# Altium schematic sheet SUP_1V.SchDoc
size A4; DocumentNumber: 14; SheetNumber: 14; SheetTotal: 30
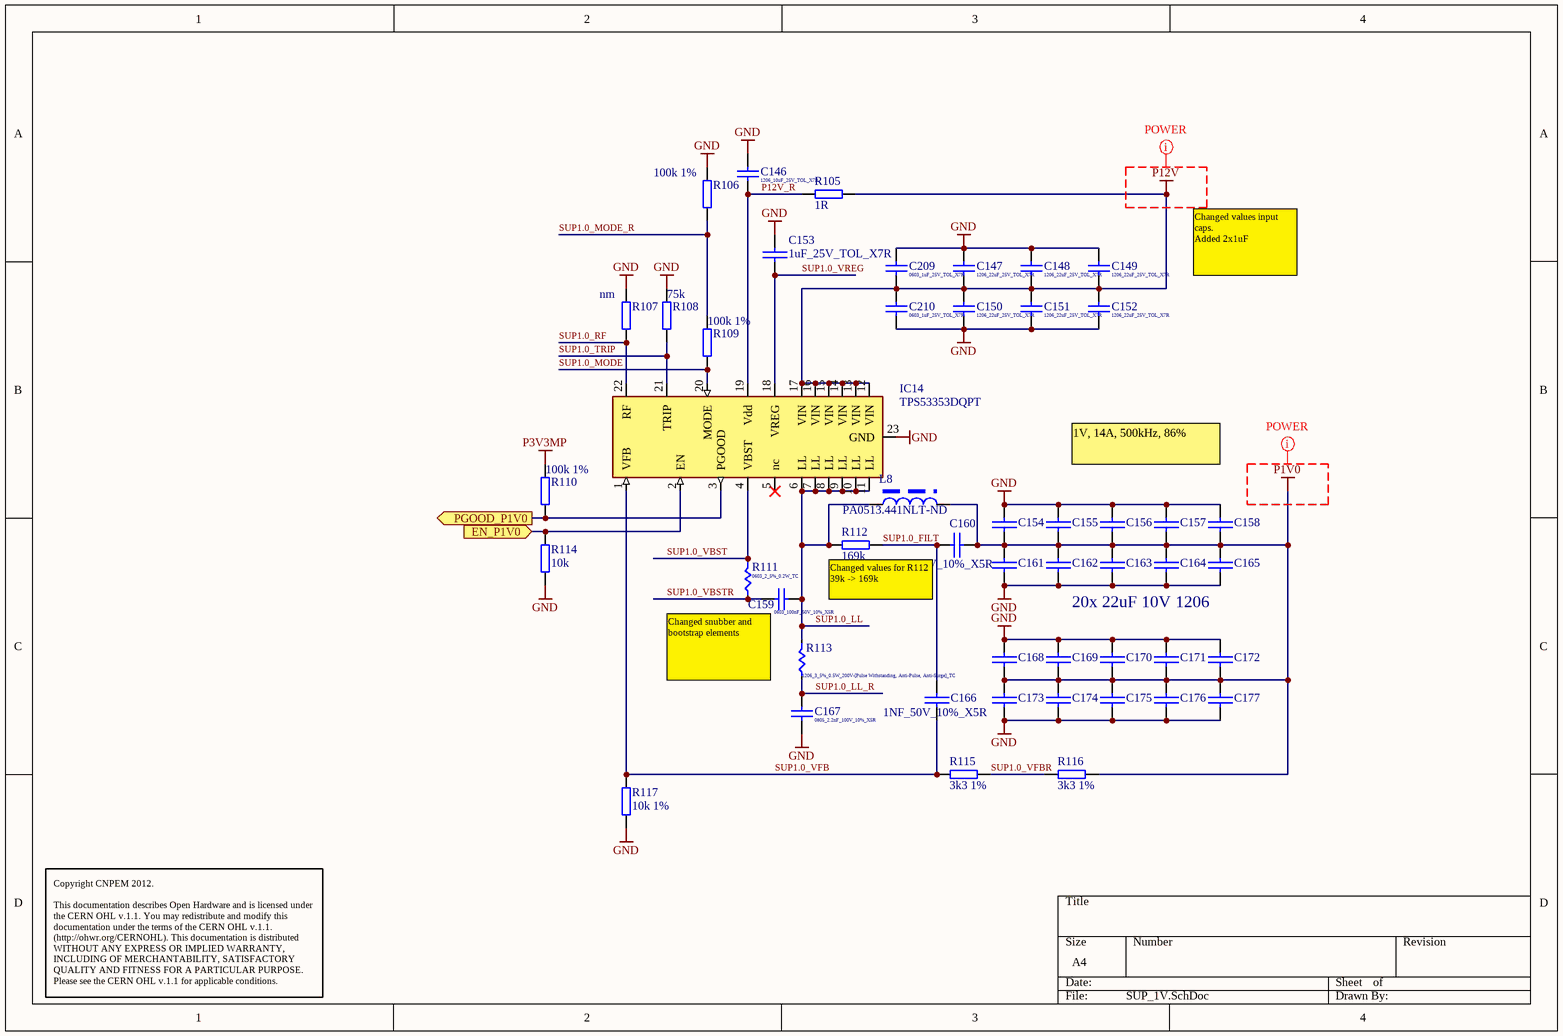
[diagram p0: SUP_1V.SchDoc]

## Parts
C146  1206_10uF_25V_TOL_X7R  [CAPC3225X140N]
C147  1206_22uF_25V_TOL_X7R  [CAPC3225X140N]
C148  1206_22uF_25V_TOL_X7R  [CAPC3225X140N]
C149  1206_22uF_25V_TOL_X7R  [CAPC3225X140N]
C150  1206_22uF_25V_TOL_X7R  [CAPC3225X140N]
C151  1206_22uF_25V_TOL_X7R  [CAPC3225X140N]
C152  1206_22uF_25V_TOL_X7R  [CAPC3225X140N]
C153  1uF_25V_TOL_X7R  [0603C]
C154  22UF_10V_10%_X7R  [1206C]  (value not drawn)
C155  22UF_10V_10%_X7R  [1206C]  (value not drawn)
C156  22UF_10V_10%_X7R  [1206C]  (value not drawn)
C157  22UF_10V_10%_X7R  [1206C]  (value not drawn)
C158  22UF_10V_10%_X7R  [1206C]  (value not drawn)
C159  0603_100nF_50V_10%_X5R  [CAPC1608X90N]
C160  22NF_50V_10%_X5R  [0402C]
C161  22UF_10V_10%_X7R  [1206C]  (value not drawn)
C162  22UF_10V_10%_X7R  [1206C]  (value not drawn)
C163  22UF_10V_10%_X7R  [1206C]  (value not drawn)
C164  22UF_10V_10%_X7R  [1206C]  (value not drawn)
C165  22UF_10V_10%_X7R  [1206C]  (value not drawn)
C166  1NF_50V_10%_X5R  [0402C]
C167  0805_2.2nF_100V_10%_X5R  [CAPC2012X140N]
C168  22UF_10V_10%_X7R  [1206C]  (value not drawn)
C169  22UF_10V_10%_X7R  [1206C]  (value not drawn)
C170  22UF_10V_10%_X7R  [1206C]  (value not drawn)
C171  22UF_10V_10%_X7R  [1206C]  (value not drawn)
C172  22UF_10V_10%_X7R  [1206C]  (value not drawn)
C173  22UF_10V_10%_X7R  [1206C]  (value not drawn)
C174  22UF_10V_10%_X7R  [1206C]  (value not drawn)
C175  22UF_10V_10%_X7R  [1206C]  (value not drawn)
C176  22UF_10V_10%_X7R  [1206C]  (value not drawn)
C177  22UF_10V_10%_X7R  [1206C]  (value not drawn)
C209  0603_1uF_25V_TOL_X7R  [CAPC1608X90N]
C210  0603_1uF_25V_TOL_X7R  [CAPC1608X90N]
IC14  TPS53353DQPT  [LCCS50P600X500X150-22N]
L8  PA0513.441NLT-ND  [IND_PA0513]
R105  1R  [0603R]
R106  100k 1%  [0603R]
R107  nm  [0603R]
R108  75k  [0603R]
R109  100k 1%  [0603R]
R110  100k 1%  [0603R]
R111  0603_2_5%_0.2W_TC  [RESC1608X64N]
R112  169k  [0603R]
R113  1206_3_5%_0.5W_200V-[Pulse Withstanding, Anti-Pulse, Anti-Surge]_TC  [RESC3216X80N]
R114  10k  [0402R]
R115  3k3 1%  [0603R]
R116  3k3 1%  [0603R]
R117  10k 1%  [0603R]

## Ports
EN_P1V0 (in), PGOOD_P1V0 (out)

## Nets
GND: C146.2 C147.2 C148.2 C149.2 C150.1 C151.1 C152.1 C153.1 C154.1 C155.1 C156.1 C157.1 C158.1 C161.2 C162.2 C163.2 C164.2 C165.2 C167.1 C168.1 C169.1 C170.1 C171.1 C172.1 C173.2 C174.2 C175.2 C176.2 C177.2 C209.2 C210.1 IC14.23(GND) R106.2 R107.2 R108.2 R114.1 R117.2
P1V0: C154.2 C155.2 C156.2 C157.2 C158.2 C160.2 C161.1 C162.1 C163.1 C164.1 C165.1 C168.2 C169.2 C170.2 C171.2 C172.2 C173.1 C174.1 C175.1 C176.1 C177.1 L8.2 R116.2
P3V3MP: R110.2
P12V: C147.1 C148.1 C149.1 C150.2 C151.2 C152.2 C209.1 C210.2 IC14.12(VIN) IC14.13(VIN) IC14.14(VIN) IC14.15(VIN) IC14.16(VIN) IC14.17(VIN) R105.1
EN_P1V0: IC14.2(EN) R114.2 ; port EN_P1V0
P12V_R: C146.1 IC14.19(Vdd) R105.2
PGOOD_P1V0: IC14.3(PGOOD) R110.1 ; port PGOOD_P1V0
SUP1.0_FILT: C160.1 C166.2 R112.1
SUP1.0_LL: C159.1 IC14.6(LL) IC14.7(LL) IC14.8(LL) IC14.9(LL) IC14.10(LL) IC14.11(LL) L8.1 R112.2 R113.1(+)
SUP1.0_LL_R: C167.2 R113.2(-)
SUP1.0_MODE: IC14.20(MODE) R109.1
SUP1.0_MODE_R: R106.1 R109.2
SUP1.0_RF: IC14.22(RF) R107.1
SUP1.0_TRIP: IC14.21(TRIP) R108.1
SUP1.0_VBST: IC14.4(VBST) R111.1(+)
SUP1.0_VBSTR: C159.2 R111.2(-)
SUP1.0_VFB: C166.1 IC14.1(VFB) R115.1 R117.1
SUP1.0_VFBR: R115.2 R116.1
SUP1.0_VREG: C153.2 IC14.18(VREG)

Not connected (* = marked no-connect by the designer): IC14 5(nc)*

## Layout directives
net class POWER: P1V0, P12V

## Notes on the sheet
- Changed values input caps.
  Added 2x1uF
- 1V, 14A, 500kHz, 86%
- Changed values for R112 39k -> 169k
- 20x 22uF 10V 1206
- Changed snubber and bootstrap elements
- Copyright CNPEM 2012.
  This documentation describes Open Hardware and is licensed under the CERN OHL v.1.1. You may redistribute and modify this documentation under the terms of the CERN OHL v.1.1. (http://ohwr.org/CERNOHL). This documentation is distributed WITHOUT ANY EXPRESS OR IMPLIED WARRANTY, INCLUDING OF MERCHANTABILITY, SATISFACTORY QUALITY AND FITNESS FOR A PARTICULAR PURPOSE. Please see the CERN OHL v.1.1 for applicable conditions.

## Library data of the parts
C146-C152 = Ceramic_1206: MiscInfo: Biggest Cern Footprint [max height]; Document Name: SUP_1V.SchDoc; Part Number: Ceramic_1206; FootprintSizeX (mm): 4.65; FootprintSizeY (mm): 2.3; FootprintRectangleArea (mm): 10.7; Thickness (Max) (mm): 1.8; FootprintAlias: 1206
C153 = CAP_SMD_0603: Capacitor SMD; Supplier 1: Digi-Key; Supplier Part Number 1: 490-1524-2-ND
C154-C158 C161-C165 C168-C177 = CAP_SMD_1206: Capacitor SMD; Supplier 1: Newark; Supplier Part Number 1: 90R7810
C159 C209 C210 = Ceramic_0603: MiscInfo: Biggest Cern Footprint [max height]; Document Name: SUP_1V.SchDoc; Part Number: Ceramic_0603; FootprintSizeX (mm): 3; FootprintSizeY (mm): 1.5; FootprintRectangleArea (mm): 4.5; Thickness (Max) (mm): 0.9; FootprintAlias: 0603
C160 C166 = CAP_SMD_0402: Capacitor SMD; Supplier 1: Newark; Supplier Part Number 1: 14T3275
C167 = Ceramic_0805: MiscInfo: Biggest Cern Footprint [max height]; Document Name: SUP_1V.SchDoc; Part Number: Ceramic_0805; FootprintSizeX (mm): 3.5; FootprintSizeY (mm): 2; FootprintRectangleArea (mm): 7; Thickness (Max) (mm): 1.4; FootprintAlias: 0805
IC14 = PM_TPS53353: High-Efficiency 20-A Synchronous Buck Converter with Eco-mode™; Supplier 1: Digi-Key; Supplier Part Number 1: 296-29490-1-ND
L8 = L_POWER_PA1513_440nH: 440nH, 30A, 0.32mOhm; Supplier 1: Mouser; Supplier Part Number 1: 673-PA0513.441NLT
R105-R110 R112 R115-R117 = RES_0603: SMD Resistor; Supplier 1: Newark; Supplier Part Number 1: 39K0073
R111 = SMT_0603: MiscInfo: Biggest Cern Footprint [max height]; Document Name: SUP_1V.SchDoc; Part Number: SMT_0603; FootprintSizeX (mm): 3; FootprintSizeY (mm): 1.5; FootprintRectangleArea (mm): 4.5; Thickness (Max) (mm): 0.64; FootprintAlias: 0603
R113 = SMT_1206: MiscInfo: Biggest Cern Footprint [max height]; Document Name: SUP_1V.SchDoc; Part Number: SMT_1206; FootprintSizeX (mm): 4.8; FootprintSizeY (mm): 2.4; FootprintRectangleArea (mm): 11.52; Thickness (Max) (mm): 0.8; FootprintAlias: 1206
R114 = RES_0402: SMD Resistor; Supplier 1: Newark; Supplier Part Number 1: 59M6691